# EAGLE design kul_rev0 (EAGLE 9.6.2)
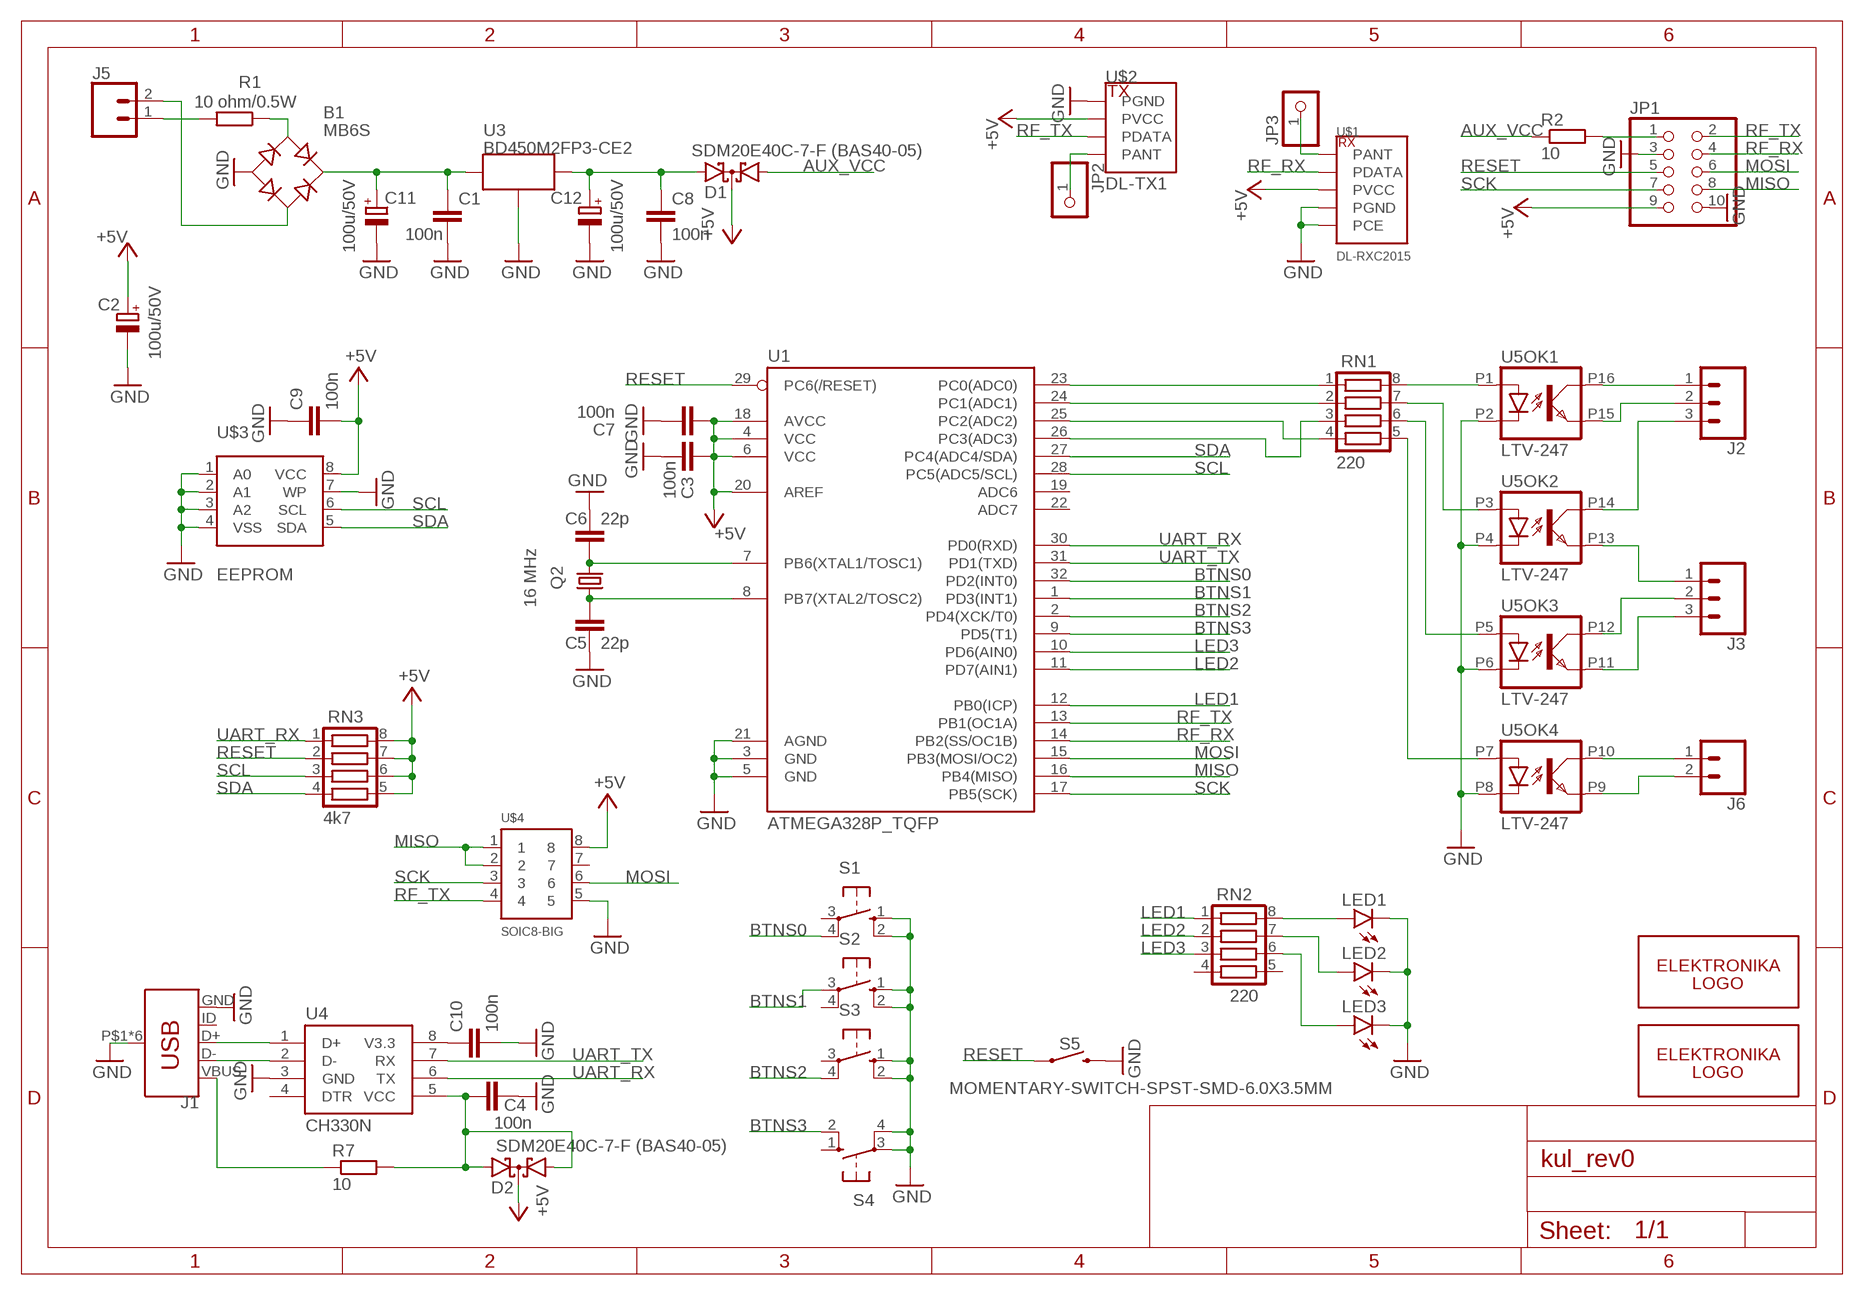
[diagram p0: schematic, sheet 1]

## Parts
B1  MB6S  [SOIC-4]
C1  100n  C-EUC0603  [C0603]
C2  100u/50V  CPOL-EUE5-6  [E5-6]
C3  100n  C-EUC0603  [C0603]
C4  100n  C-EUC0603  [C0603]
C5  22p  C-EUC0603  [C0603]
C6  22p  C-EUC0603  [C0603]
C7  100n  C-EUC0603  [C0603]
C8  100n  C-EUC0603  [C0603]
C9  100n  C-EUC0603  [C0603]
C10  100n  C-EUC0603  [C0603]
C11  100u/50V  CPOL-EUE5-6  [E5-6]
C12  100u/50V  CPOL-EUE5-6  [E5-6]
D1  SDM20E40C-7-F (BAS40-05)  BAS40-05  [SOT23]
D2  SDM20E40C-7-F (BAS40-05)  BAS40-05  [SOT23]
J1  USB_MICRO-BLCSC  [C40951_USB]
J2  CONN_03SCREW_LOCK  [SCREWTERMINAL-3.5MM-3_LOCK.007S]
J3  CONN_03SCREW_LOCK  [SCREWTERMINAL-3.5MM-3_LOCK.007S]
J5  CONN_023.5MM  [SCREWTERMINAL-3.5MM-2]
J6  CONN_023.5MM  [SCREWTERMINAL-3.5MM-2]
JP1  PINHD-2X5  [2X05]
JP2  PINHD-1X1  [1X01]
JP3  PINHD-1X1  [1X01]
LED1  LEDCHIP-LED0805  [CHIP-LED0805]
LED2  LEDCHIP-LED0805  [CHIP-LED0805]
LED3  LEDCHIP-LED0805  [CHIP-LED0805]
Q2  16 MHz  KX-7  [3.2X2.5_KX-7]
R1  10 ohm/0.5W  R-EU_R0805  [R0805]
R2  10  R-EU_R0603  [R0603]
R7  10  R-EU_R0603  [R0603]
RN1  220  CTS742C083  [CTS742C083]
RN2  220  CTS742C083  [CTS742C083]
RN3  4k7  CTS742C083  [CTS742C083]
S1  10-XX  [B3F-10XX]
S2  10-XX  [B3F-10XX]
S3  10-XX  [B3F-10XX]
S4  10-XX  [B3F-10XX]
S5  MOMENTARY-SWITCH-SPST-SMD-6.0X3.5MM  [TACTILE_SWITCH_SMD_6.0X3.5MM]
U1  ATMEGA328P_TQFP  [TQFP32-08]
U3  BD450M2FP3-CE2  C308597_LDO  [C308597_LDO]
U4  CH330N  [SOIC8]
U5  LTV-247  [SOP-16_4.4MM]
U$1  DL-RXC2015  [DL-RXC2015]
U$2  DL-TX1  [DL-TX1]
U$3  EEPROM  [SOIC8]
U$4  SOIC8-BIG  [SOIC8_BIG]
U$5  ELEKTRONIKA_BA_ELEBA_LOGO-121  [ELEKTRONIKA_BA_ELEBALOGO_ELEBALOGO_B_121]
U$6  ELEKTRONIKA_BA_ELEBA_LOGO  [ELEKTRONIKA_BA_ELEBALOGO_ELEBALOGO_B_122]

## Nets
+5V: C2.+ C3.2 C7.2 C9.2 D1.3(C) D2.3(C) JP1.9 RN3.5 RN3.6 RN3.7 RN3.8 U1.4(VCC) U1.6(VCC) U1.18(AVCC) U1.20(AREF) U$1.PVCC U$2.PVDD(PVCC) U$3.8(VCC) U$4.8
AUX_VCC: D1.1(A1) R2.1
BTNS0: S1.4(P1) U1.32(PD2(INT0))
BTNS1: S2.3(P) U1.1(PD3(INT1))
BTNS2: S3.4(P1) U1.2(PD4(XCK/T0))
BTNS3: S4.2(S1) U1.9(PD5(T1))
GND: B1.- C1.2 C2.- C3.1 C4.2 C5.2 C6.1 C7.1 C8.2 C9.1 C10.2 C11.- C12.- J1.GND J1.P$1(SHIELD) J1.P$2(SHIELD) J1.P$3(SHIELD) J1.P$4(SHIELD) J1.SHIELD1(SHIELD) J1.SHIELD2(SHIELD) JP1.3 JP1.10 LED1.C LED2.C LED3.C S1.1(S) S1.2(S1) S2.1(S) S2.2(S1) S3.1(S) S3.2(S1) S4.3(P) S4.4(P1) S5.2 U1.3(GND) U1.5(GND) U1.21(AGND) U3.PGND1(PGND) U3.PGND2(PGND) U4.3(GND) U5.P2(OK1:C) U5.P4(OK2:C) U5.P6(OK3:C) U5.P8(OK4:C) U$1.PCE U$1.PGND1(PGND) U$1.PGND2(PGND) U$2.PGND U$3.1(A0) U$3.2(A1) U$3.3(A2) U$3.4(VSS) U$3.7(WP) U$4.5
LED1: RN2.1 U1.12(PB0(ICP))
LED2: RN2.2 U1.11(PD7(AIN1))
LED3: RN2.3 U1.10(PD6(AIN0))
MISO: JP1.8 U1.16(PB4(MISO)) U$4.1 U$4.2
MOSI: JP1.6 U1.15(PB3(MOSI/OC2)) U$4.6
N$1: RN1.8 U5.P1(OK1:A)
N$2: RN1.7 U5.P3(OK2:A)
N$3: RN1.6 U5.P5(OK3:A)
N$4: RN1.5 U5.P7(OK4:A)
N$5: RN1.4 U1.25(PC2(ADC2))
N$6: RN1.3 U1.26(PC3(ADC3))
N$8: J1.D+ U4.1(D+)
N$9: B1.~1(AC1) R1.1
N$10: B1.~2(AC2) J5.2
N$11: B1.+ C1.1 C11.+ U3.PIN
N$12: C8.1 C12.+ D1.2(A2) U3.POUT
N$13: J5.1 R1.2
N$14: J1.D- U4.2(D-)
N$15: J1.VBUS R7.1
N$16: C4.1 D2.1(A1) D2.2(A2) R7.2 U4.5(VCC)
N$17: C10.1 U4.8(V3.3)
N$18: J2.1 U5.P16(OK1:COL)
N$19: J2.2 U5.P15(OK1:EMIT)
N$20: J2.3 U5.P14(OK2:COL)
N$21: J3.1 U5.P13(OK2:EMIT)
N$22: J3.2 U5.P12(OK3:COL)
N$23: J3.3 U5.P11(OK3:EMIT)
N$24: J6.1 U5.P10(OK4:COL)
N$25: J6.2 U5.P9(OK4:EMIT)
N$26: RN1.1 U1.23(PC0(ADC0))
N$27: RN1.2 U1.24(PC1(ADC1))
N$30: JP2.1 U$2.PANT
N$31: JP3.1 U$1.PANT
N$32: LED1.A RN2.8
N$33: LED2.A RN2.7
N$34: LED3.A RN2.6
N$35: JP1.1 R2.2
OSC1: C6.2 Q2.3 U1.7(PB6(XTAL1/TOSC1))
OSC2: C5.1 Q2.1 U1.8(PB7(XTAL2/TOSC2))
RESET: JP1.5 RN3.2 S5.1 U1.29(PC6(/RESET))
RF_RX: JP1.4 U1.14(PB2(SS/OC1B)) U$1.PDATA
RF_TX: JP1.2 U1.13(PB1(OC1A)) U$2.PDATA U$4.4
SCK: JP1.7 U1.17(PB5(SCK)) U$4.3
SCL: RN3.3 U1.28(PC5(ADC5/SCL)) U$3.6(SCL)
SDA: RN3.4 U1.27(PC4(ADC4/SDA)) U$3.5(SDA)
UART_RX: RN3.1 U1.30(PD0(RXD)) U4.6(TX)
UART_TX: U1.31(PD1(TXD)) U4.7(RX)
Unconnected: J1.ID RN2.4 RN2.5 S1.3(P) S2.4(P1) S3.3(P) S4.1(S) U1.19(ADC6) U1.22(ADC7) U4.4(DTR) U$4.7

## Library data of the parts
B1 = rectifier:MB*S: Bridge Rectifier Source: http://www.fairchildsemi.com/ds/MB/MB6S.pdf
C1 C3-C10 = rcl:C-EU: CAPACITOR, European symbol; SPICEPREFIX: C
C2 C11 C12 = rcl:CPOL-EU: POLARIZED CAPACITOR, European symbol; SPICEPREFIX: C
D1 D2 = diode:BAS40-05: Silicon Schottky Diodes General-purpose diode for high-speed switching
J1 = trax_832:USB_MICRO-B: USB Type Micro-B Connector Male/female and PTH/SMT variants SparkFun Products: SparkFun microB USB Breakout <https://www.sparkfun.com/products/12035> SparkFun USB microB Plug Breakout <https://www.sparkfun.com/products/10031> SparkFun ESP8266 Thing <https://www.sparkfun.com/products/13231>
J2 J3 = SparkFun-Connectors:CONN_03: Multi connection point. Often used as Generic Header-pin footprint for 0.1 inch spaced/style header connections On any of the 0.1 inch spaced packages, you can populate with these: Break Away Headers - Straight <https://www.sparkfun.com/products/116> (PRT-00116) Break Away Male Headers - Right Angle <https://www.sparkfun.com/products/553> (PRT-00553) Female Headers <https://www.sparkfun.com/products/115> (PRT-00115) Break Away Headers - Machine Pin <https://www.sparkfun.com/products/117> (PRT-00117) Break Away Female Headers - Swiss Machine Pin <https://www.sparkfun.com/products/743> (PRT-00743) Stackable Header - 3 Pin (Female, 0.1") <https://www.sparkfun.com/products/13875> (PRT-13875) For SCREWTERMINALS and SPRING TERMINALS visit here: Screw Terimnals on SparkFun.com <https://www.sparkfun.com/search/results?term=Screw+Terminals> (5mm/3.5mm/2.54mm spacing) This device is also useful as a general connection point to wire up your design to another part of your project. Our various solder wires solder well into these plated through hole pads. Hook-Up Wire - Assortment (Stranded, 22 AWG) <https://www.sparkfun.com/products/11375> (PRT-11375) Hook-Up Wire - Assortment (Solid Core, 22 AWG) <https://www.sparkfun.com/products/11367> (PRT-11367) View the entire wire category on our website here <https://www.sparkfun.com/categories/141> Special notes: Molex polarized connector foot print use with SKU : PRT-08232 with associated crimp pins and housings.; PROD_ID: CONN-08288; SF_ID: PRT-08235
J5 J6 = SparkFun-Connectors:CONN_02: Multi connection point. Often used as Generic Header-pin footprint for 0.1 inch spaced/style header connections On any of the 0.1 inch spaced packages, you can populate with these: Break Away Headers - Straight <https://www.sparkfun.com/products/116> (PRT-00116) Break Away Male Headers - Right Angle <https://www.sparkfun.com/products/553> (PRT-00553) Female Headers <https://www.sparkfun.com/products/115> (PRT-00115) Break Away Headers - Machine Pin <https://www.sparkfun.com/products/117> (PRT-00117) Break Away Female Headers - Swiss Machine Pin <https://www.sparkfun.com/products/743> (PRT-00743) For SCREWTERMINALS and SPRING TERMINALS visit here: Screw Terimnals on SparkFun.com <https://www.sparkfun.com/search/results?term=Screw+Terminals> (5mm/3.5mm/2.54mm spacing) This device is also useful as a general connection point to wire up your design to another part of your project. Our various solder wires solder well into these plated through hole pads. Hook-Up Wire - Assortment (Stranded, 22 AWG) <https://www.sparkfun.com/products/11375> (PRT-11375) Hook-Up Wire - Assortment (Solid Core, 22 AWG) <https://www.sparkfun.com/products/11367> (PRT-11367) View the entire wire category on our website here <https://www.sparkfun.com/categories/141> Special notes: Molex polarized connector foot print use with: PRT-08233 with associated crimp pins and housings. 2.54_SCREWTERM for use with PRT-10571. 3.5mm Screw Terminal footprints for PRT-08084 5mm Screw Terminal footprints for use with PRT-08432; PROD_ID: CONN-08399
JP1 = pinhead:PINHD-2X5: PIN HEADER
JP2 JP3 = pinhead:PINHD-1X1: PIN HEADER
LED1-LED3 = led:LED: LED OSRAM: - CHIPLED LG R971, LG N971, LY N971, LG Q971, LY Q971, LO R971, LY R971 LH N974, LH R974 LS Q976, LO Q976, LY Q976 LO Q996 - Hyper CHIPLED LW Q18S LB Q993, LB Q99A, LB R99A - SideLED LS A670, LO A670, LY A670, LG A670, LP A670 LB A673, LV A673, LT A673, LW A673 LH A674 LY A675 LS A676, LA A676, LO A676, LY A676, LW A676 LS A679, LY A679, LG A679 - Hyper Micro SIDELED® LS Y876, LA Y876, LO Y876, LY Y876 LT Y87S - SmartLED LW L88C, LW L88S LB L89C, LB L89S, LG L890 LS L89K, LO L89K, LY L89K LS L896, LA L896, LO L896, LY L896 - TOPLED LS T670, LO T670, LY T670, LG T670, LP T670 LSG T670, LSP T670, LSY T670, LOP T670, LYG T670 LG T671, LOG T671, LSG T671 LB T673, LV T673, LT T673, LW T673 LH T674 LS T676, LA T676, LO T676, LY T676, LB T676, LH T676, LSB T676, LW T676 LB T67C, LV T67C, LT T67C, LS T67K, LO T67K, LY T67K, LW E67C LS E67B, LA E67B, LO E67B, LY E67B, LB E67C, LV E67C, LT E67C LW T67C LS T679, LY T679, LG T679 LS T770, LO T770, LY T770, LG T770, LP T770 LB T773, LV T773, LT T773, LW T773 LH T774 LS E675, LA E675, LY E675, LS T675 LS T776, LA T776, LO T776, LY T776, LB T776 LHGB T686 LT T68C, LB T68C - Hyper Mini TOPLED® LB M676 - Mini TOPLED Santana® LG M470 LS M47K, LO M47K, LY M47K Source: http://www.osram.convergy.de LUXEON: - LUMILED® LXK2-PW12-R00, LXK2-PW12-S00, LXK2-PW14-U00, LXK2-PW14-V00 LXK2-PM12-R00, LXK2-PM12-S00, LXK2-PM14-U00 LXK2-PE12-Q00, LXK2-PE12-R00, LXK2-PE12-S00, LXK2-PE14-T00, LXK2-PE14-U00 LXK2-PB12-K00, LXK2-PB12-L00, LXK2-PB12-M00, LXK2-PB14-N00, LXK2-PB14-P00, LXK2-PB14-Q00 LXK2-PR12-L00, LXK2-PR12-M00, LXK2-PR14-Q00, LXK2-PR14-R00 LXK2-PD12-Q00, LXK2-PD12-R00, LXK2-PD12-S00 LXK2-PH12-R00, LXK2-PH12-S00 LXK2-PL12-P00, LXK2-PL12-Q00, LXK2-PL12-R00 Source: www.luxeon.com KINGBRIGHT: KA-3528ASYC Source: www.kingbright.com
Q2 = crystal-geyer_V1_0:KX: Quartz Crystals (MHz) SMD: KX - Serie Model Size l/w/h [mm] Frequency Range Frequency Stability Temp. Range [°C] Load Capacitance AECQ 200 availabel Datasheet KX-4 KX-5 KX-6 KX-7 KX-9A KX-9B KX-12A KX-12B KX-13 KX-20 KX-K KX-KS 1.6/1.2/0.3 2.0/1.6/0.45 2.5/2.0/0.55 3.2/2.5/0.8 5.0/3.2/1.0 5.0/3.2/1.1 6.0/3.5/1.1 6.0/3.5/1.0 7.0/5.0 /1.3 11.6/5.5/1.6 12.3/4.5/4.2 12.3/4.5/3.2 24.0 ~ 80.0 MHz 16.0 ~ 80.0 MHz 12.0 ~ 80.0 MHz 8.0 ~ 60.0 MHz 7,68 ~ 300,0 MHz 8,0 ~ 50,0 MHz 8,0 ~ 150,0 MHz 8,0 ~ 50,0 MHz 6,0 ~ 160,0 MHz 3,579 ~ 25,0 MHz 3,579 ~ 70,0 MHz 3,579 ~ 70,0 MHz ±10 … ±50ppm ±10 … ±50ppm ±10 … ±50ppm ±10 … ±50ppm ±10 … ±50ppm ±10 … ±50ppm ±10 … ±50ppm ±10 … ±50ppm ±10 … ±50ppm ±50ppm ±10 … ±50ppm ±10 … ±50ppm (*) -40°C …+85°C (*) -40°C …+125°C (*) -40°C …+125°C (*) -40°C …+125°C (*) -40°C …+105°C (*) -40°C …+105°C (*) -40°C …+125°C (*) -40°C …+105°C (*) -40°C …+105°C (*) -40°C …+105°C (*) -40°C …+85°C (*) -40°C …+85°C 8, 8…16 8, 8…16 10, 8…16 12, 7…20 16, 10…20 16, 10…20 16, 10…20 16, 12…20 16, 12…20 16, 12…20 16, 12…30 16, 12…30 - yes yes yes - - - - - - - - KX-4.pdf <http://www.geyer-electronic.de/uploads/tx_userartikelfrequenz/GEYER-KX-4.pdf> KX-5.pdf <http://www.geyer-electronic.de/uploads/tx_userartikelfrequenz/GEYER-KX-5.pdf> KX-6.pdf <http://www.geyer-electronic.de/uploads/tx_userartikelfrequenz/GEYER-KX-6.pdf> KX-7.pdf <http://www.geyer-electronic.de/uploads/tx_userartikelfrequenz/GEYER-KX-7.pdf> KX-9A.pdf <http://www.geyer-electronic.de/uploads/tx_userartikelfrequenz/GEYER-KX-9A.pdf> KX-9B.pdf <http://www.geyer-electronic.de/uploads/tx_userartikelfrequenz/GEYER-KX-9B.pdf> KX-12A.pdf <http://www.geyer-electronic.de/uploads/tx_userartikelfrequenz/GEYER-KX-12A.pdf> KX-12B.pdf <http://www.geyer-electronic.de/uploads/tx_userartikelfrequenz/GEYER-KX-12B.pdf> KX-13.pdf <http://www.geyer-electronic.de/uploads/tx_userartikelfrequenz/GEYER-KX-13.pdf> KX-20.pdf <http://www.geyer-electronic.de/uploads/tx_userartikelfrequenz/GEYER-KX-20.pdf> KX-K.pdf <http://www.geyer-electronic.de/uploads/tx_userartikelfrequenz/GEYER-KX-K.pdf> KX-KS.pdf <http://www.geyer-electronic.de/uploads/tx_userartikelfrequenz/GEYER-KX-KS.pdf> <http://www.geyer-electronic.de/fileadmin/template/img/logo-geyer-electronic.png> Details see: http://www.geyer-electronic.de/Frequenz-Produkte.9.0.html Created 2016-06-07, Hans Locher 2016 (C) Geyer Quartz Technology KX4,KX5,KX6,KX7,KX9A,KX9B,KX12A,KX12B,KX13,KX20,KXK,KXKS;1612;2016;2520;3225;5032;6035;7050;11655;12345;1,6x1,2;2,0x1,6;2,5x2,0;3,2x2,5;5,0x3,2;6,0x3,5;7,0x5,0;11,6x5,5;12,3x4,5;12,3x4,5;1.6x1.2;2.0x1.6;2.5x2.0;3.2x2.5;5.0x3.2;6.0x3.5;7.0x5.0;11.6x5.5;12.3x4.5;12.3x4.5;
R1 R2 R7 = rcl:R-EU_: RESISTOR, European symbol; SPICEPREFIX: R
RN1-RN3 = resistor-net:CTS742C083: Chip Resistor Array 4 Single Resistor Source: http://www.ctscorp.com/components/Datasheets/CTSChipArrayDs.pdf; OC_FARNELL: unknown; OC_NEWARK: unknown
S1-S4 = trax_832:10-XX: OMRON SWITCH; MPN: B3F-1000; OC_FARNELL: 176432; OC_NEWARK: 36M3542
S5 = SparkFun-Switches:MOMENTARY-SWITCH-SPST: Momentary Switch (Pushbutton) - SPST Normally-open (NO) SPST momentary switches (buttons, pushbuttons). Variants PTH-12MM - 12mm square, through-hole Momentary Pushbutton Switch - 12mm Square <https://www.sparkfun.com/products/9190> (COM-09190) PTH-6.0MM, PTH-6.0MM-KIT - 6.0mm square, through-hole Mini Pushbutton Switch <https://www.sparkfun.com/products/97> (COM-00097) KIT package intended for soldering kit's - only one side of pads' copper is exposed. PTH-RIGHT-ANGLE-KIT - Right-angle, through-hole Right Angle Tactile Button <https://www.sparkfun.com/products/10791> - Used on SparkFun BigTime Watch Kit <https://www.sparkfun.com/products/11734> SMD-12MM - 12mm square, surface-mount Tactile Button - SMD (12mm) <https://www.sparkfun.com/products/12993> (COM-12993) Used on SparkFun PicoBoard <https://www.sparkfun.com/products/11888> SMD-4.5MM - 4.5mm Square Trackball Switch Used on SparkFun Blackberry Trackballer Breakout <https://www.sparkfun.com/products/13169> SMD-4.6MMX2.8MM - 4.60mm x 2.80mm, surface mount Used on SparkFun SAMD21 Mini Breakout <https://www.sparkfun.com/products/13664> SMD-5.2MM, SMD-5.2-REDUNDANT - 5.2mm square, surface-mount Mini Pushbutton Switch - SMD <https://www.sparkfun.com/products/8720> (COM-08720) Used on Arduino Pro Mini <https://www.sparkfun.com/products/11114> REDUNDANT package connects both switch circuits together SMD-6.0X3.5MM - 6.0 x 3.5mm, surface mount Momentary Reset Switch SMD <https://www.sparkfun.com/products/8229> (COM-08229) SMD-6.2MM-TALL - 6.2mm square, surface mount Tactile Button - SMD (6mm) <https://www.sparkfun.com/products/12992> Used on SparkFun Digital Sandbox <https://www.sparkfun.com/products/12651> SMD-RIGHT-ANGLE - Right-angle, surface mount Used on SparkFun Block for Intel® Edison - Arduino <https://www.sparkfun.com/products/13036>; PROD_ID: SWCH-00815; SF_SKU: COM-08229
U1 = SparkFun-IC-Microcontroller:ATMEGA328P_TQFP: Popular 328P in QFP Storefront component: ATmega328 - TQFP <https://www.sparkfun.com/products/13448> (COM-13448) Datasheet <http://www.sparkfun.com/datasheets/Components/SMD/ATMega328.pdf> SparkFun Products SparkFun RedBoard - Programmed with Arduino <https://www.sparkfun.com/products/12757> (DEV-12757) Arduino Pro Mini 328 - 5V/16MHz <https://www.sparkfun.com/products/11113> (DEV-11113) Arduino Pro Mini 328 - 3.3V/8MHz <https://www.sparkfun.com/products/11114> (DEV-11114) SparkFun OpenLog <https://www.sparkfun.com/products/13712> (DEV-13712) SparkFun MicroView - OLED Arduino Module <https://www.sparkfun.com/products/12923> (DEV-12923) SparkFun Digital Sandbox <https://www.sparkfun.com/products/12651> (DEV-12651) SparkFun PicoBoard <https://www.sparkfun.com/products/11888> (WIG-11888) Arduino Fio <https://www.sparkfun.com/products/10116> (DEV-10116) LilyPad Arduino 328 Main Board <https://www.sparkfun.com/products/13342> (DEV-13342) SparkFun RedStick <https://www.sparkfun.com/products/13741> (DEV-13741) LilyPad MP3 <https://www.sparkfun.com/products/11013> (DEV-11013) LilyPad Arduino SimpleSnap <https://www.sparkfun.com/products/10941> (DEV-10941) SparkFun Stepoko <https://www.sparkfun.com/products/13899> (ROB-13899) SparkFun Geiger Counter <https://www.sparkfun.com/products/11345> (SEN-11345) SparkFun EL Sequencer <https://www.sparkfun.com/products/12781> (COM-12781) Arduino Pro 328 - 5V/16MHz <https://www.sparkfun.com/products/10915> (DEV-10915) CryptoCape <https://www.sparkfun.com/products/12773> (DEV-12773) SparkFun IR Thermometer Evaluation Board - MLX90614 <https://www.sparkfun.com/products/10740> (SEN-10740) SparkFun RedBot Mainboard <https://www.sparkfun.com/products/12097> (ROB-12097) Arduino Pro 328 - 3.3V/8MHz <https://www.sparkfun.com/products/10914> (DEV-10914) SparkFun Block for Intel® Edison - Arduino <https://www.sparkfun.com/products/13036> (DEV-13036) SparkFun Simon Says - Surface Mount Soldering Kit <https://www.sparkfun.com/products/10935> (KIT-10935) SparkFun 7-Segment Serial Display - Red <https://www.sparkfun.com/products/11441> (COM-11441) SparkFun 7-Segment Serial Display - White <https://www.sparkfun.com/products/11629> (COM-11629) SparkFun 7-Segment Serial Display - Yellow <https://www.sparkfun.com/products/11443> (COM-11443) SparkFun 7-Segment Serial Display - Kelly Green <https://www.sparkfun.com/products/11440> (COM-11440) SparkFun 7-Segment Serial Display - Blue <https://www.sparkfun.com/products/11442> (COM-11442) SparkFun OpenSegment Serial Display - 20mm (Blue) <https://www.sparkfun.com/products/11647> (COM-11647) SparkFun OpenSegment Serial Display - 20mm (Green) <https://www.sparkfun.com/products/11646> (COM-11646) SparkFun OpenSegment Serial Display - 20mm (White) <https://www.sparkfun.com/products/11648> (COM-11648) SparkFun OpenSegment Serial Display - 20mm (Red) <https://www.sparkfun.com/products/11644> (COM-11644) SparkFun OpenSegment Serial Display - 20mm (Yellow) <https://www.sparkfun.com/products/11645> (COM-11645) SparkFun OpenSegment Shield <https://www.sparkfun.com/products/13190> (DEV-13190); PROD_ID: IC-09069
U3 = trax_832:C308597_LDO
U4 = trax_832:CH330N
U5 = trax_832:LTV-247
U$1 = trax_832:DL-RXC2015
U$2 = trax_832:DL-TX1
U$3 = trax_832:EEPROM
U$4 = trax_832:SOIC8-BIG
U$5 U$6 = elebalogo:ELEKTRONIKA_BA_ELEBA_LOGO

## Board
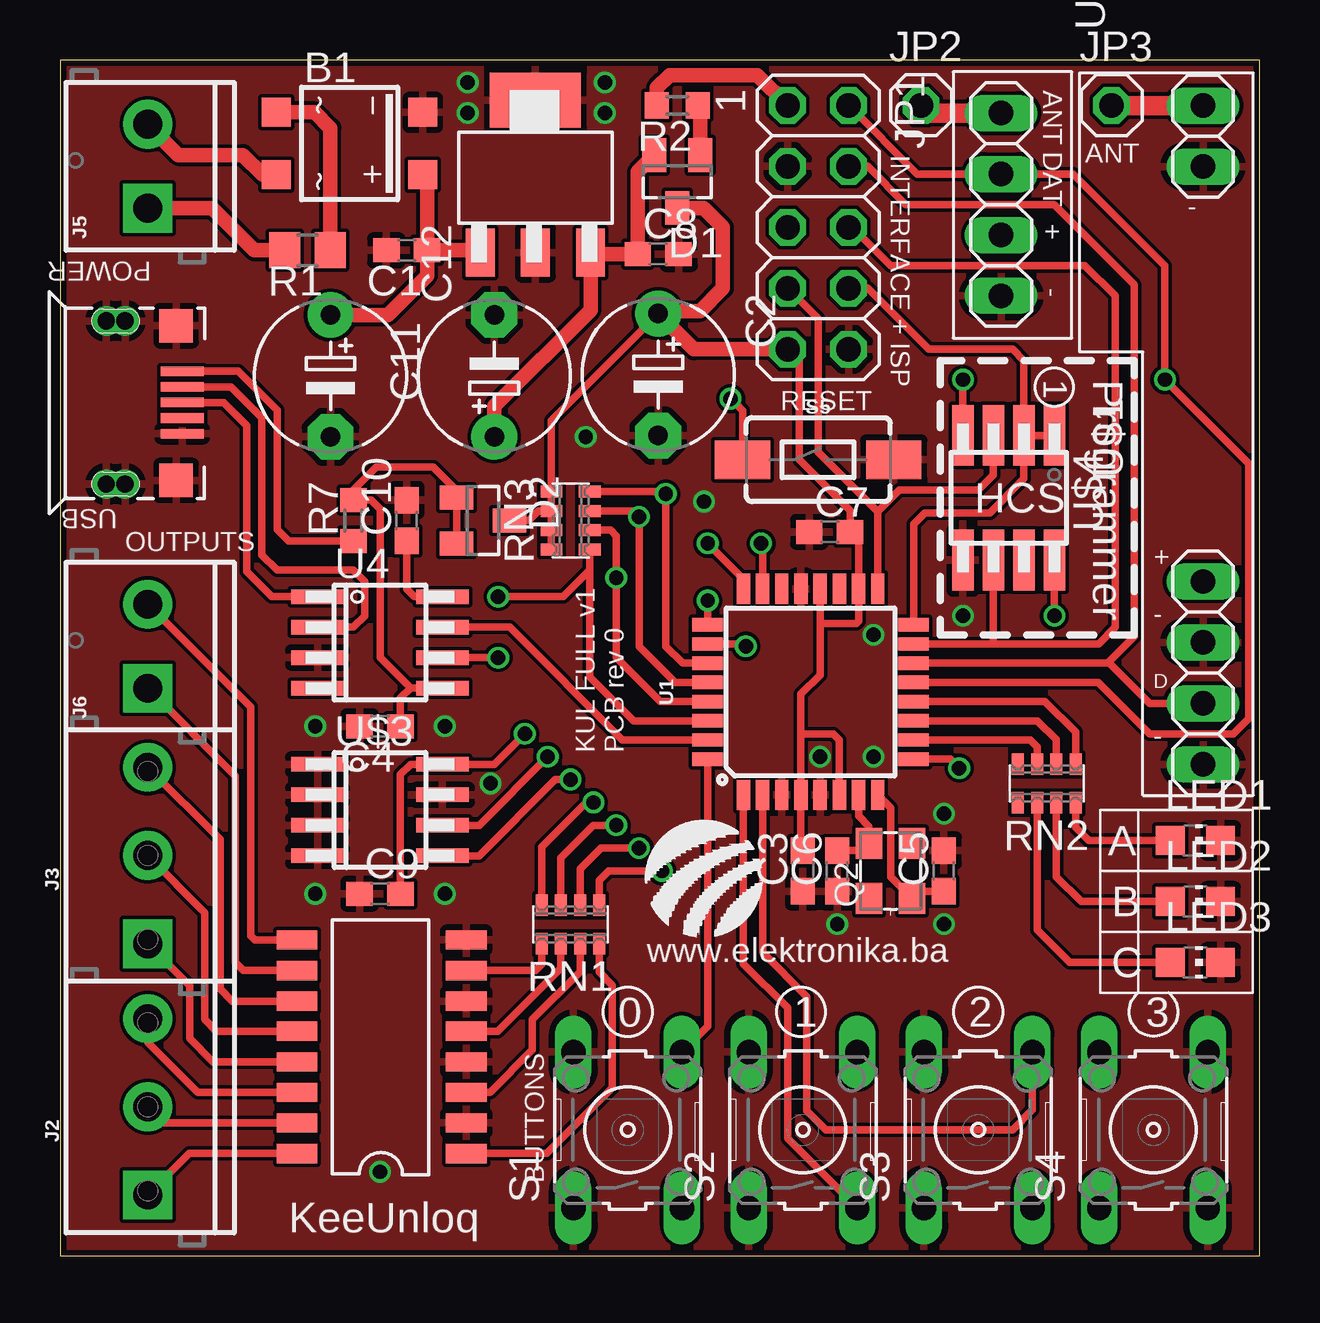
[diagram p1: board, top side]
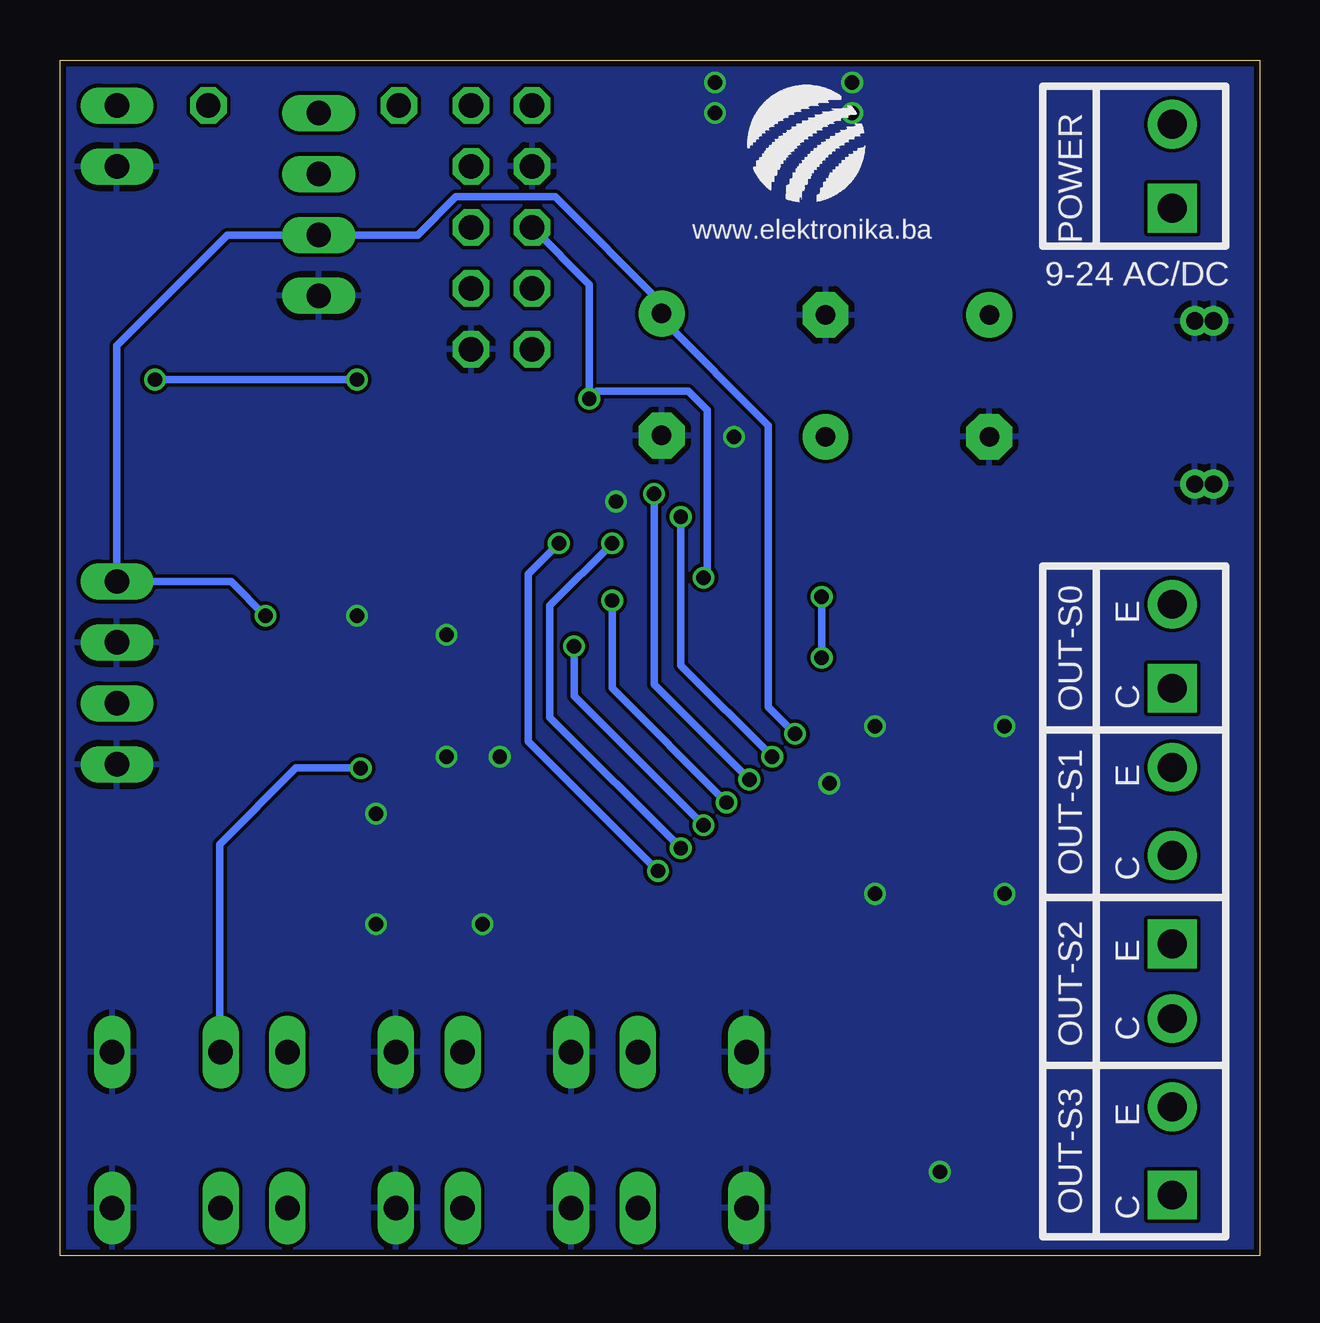
[diagram p2: board, bottom side, seen from below]

Size 49.99 x 49.84 mm. Coordinates in mm from the lower left corner, seen from the top.
Outline: 0,0 49.99,0 49.99,49.84 0,49.84 0,0
Copper layers (1*16): Top 0.035mm / dielectric 1.5mm / Bottom 0.035mm
Design rules "Fusion_eagle_rule_v1.1": minimum track width 6mil, minimum drill 12mil, track to track 6mil, track to pad 6mil, pad to pad 6mil, via to via 6mil, smd to smd 0mil, copper to edge 10mil, drill to drill 10mil, minimum pad ring 10mil, minimum via ring 6mil, stop-mask expansion 2mil, vias tented up to drill 100mil, thermal gap 10mil

### Footprints (pad centres in the part's own frame; a part is rotated, then mirrored left to right if it is on the bottom)
SOIC-4 = smd 1.2 x 1.2: + 1.3,3.05; - -1.3,3.05; ~1 -1.3,-3.05; ~2 1.3,-3.05
C0603 = smd 1.1 x 1: 1 -0.85,0; 2 0.85,0
E5-6 = drill 0.813 pad 1.905: + -2.54,0 | drill 0.813 pad 1.905 octagon: - 2.54,0
SOT23 = smd 1 x 1.4: 1 -0.95,-1.1; 2 0.95,-1.1; 3 0,1.1
C40951_USB = smd 1.8 x 0.4: D+ -2.55,0; D- -2.55,-0.65; GND -2.55,1.3; ID -2.55,0.65; VBUS -2.55,-1.3 | drill 0.72 pad 1.2: P$1 -0.17,3.4; P$2 0.61,3.4; P$3 -0.17,-3.4; P$4 0.61,-3.4 | smd 1.4 x 1.4: SHIELD1 -2.3,3.25; SHIELD2 -2.3,-3.2
SCREWTERMINAL-3.5MM-3_LOCK.007S = drill 1.2 pad 2.032 square: 1 -0.178,0 | drill 1.2 pad 2.032: 2 3.5,0; 3 7.178,0
SCREWTERMINAL-3.5MM-2 = drill 1.2 pad 2.032 square: 1 0,0 | drill 1.2 pad 2.032: 2 3.5,0
2X05 = drill 1.016 octagon: 1 -5.08,-1.27; 2 -5.08,1.27; 3 -2.54,-1.27; 4 -2.54,1.27; 5 0,-1.27; 6 0,1.27; 7 2.54,-1.27; 8 2.54,1.27; 9 5.08,-1.27; 10 5.08,1.27
1X01 = drill 1.016 octagon: 1 0,0
CHIP-LED0805 = smd 1.2 x 1.2: A 0,-1.05; C 0,1.05
3.2X2.5_KX-7 = smd 1.3 x 1.1: 1 -1.15,-0.9; 2 1.15,-0.9; 3 1.15,0.9; 4 -1.15,0.9
R0805 = smd 1.3 x 1.5: 1 -0.95,0; 2 0.95,0
R0603 = smd 1 x 1.1: 1 -0.85,0; 2 0.85,0
CTS742C083 = smd 0.5 x 0.9: 1 -1.2,-0.8; 2 -0.4,-0.8; 3 0.4,-0.8; 4 1.2,-0.8; 5 1.2,0.8; 6 0.4,0.8; 7 -0.4,0.8; 8 -1.2,0.8
B3F-10XX = drill 1.016 long: 1 -3.251,2.261; 2 3.251,2.261; 3 -3.251,-2.261; 4 3.251,-2.261
TACTILE_SWITCH_SMD_6.0X3.5MM = smd 2.3 x 1.6: 1 -3.15,0; 2 3.15,0
TQFP32-08 = smd 1.27 x 0.559: 1 -4.293,2.8; 2 -4.293,2; 3 -4.293,1.2; 4 -4.293,0.4; 5 -4.293,-0.4; 6 -4.293,-1.2; 7 -4.293,-2; 8 -4.293,-2.8; 17 4.293,-2.8; 18 4.293,-2; 19 4.293,-1.2; 20 4.293,-0.4; 21 4.293,0.4; 22 4.293,1.2; 23 4.293,2; 24 4.293,2.8 | smd 0.559 x 1.27: 9 -2.8,-4.293; 10 -2,-4.293; 11 -1.2,-4.293; 12 -0.4,-4.293; 13 0.4,-4.293; 14 1.2,-4.293; 15 2,-4.293; 16 2.8,-4.293; 25 2.8,4.293; 26 2,4.293; 27 1.2,4.293; 28 0.4,4.293; 29 -0.4,4.293; 30 -1.2,4.293; 31 -2,4.293; 32 -2.8,4.293
C308597_LDO = smd 2.3 x 3.8: PGND1 -3.232,-0.036 | smd 2 x 1.2: PGND2 3.118,-0.036; PIN 3.118,-2.336; POUT 3.118,2.264
SOIC8 = smd 0.6 x 2.2: 1 -1.905,-2.6; 2 -0.635,-2.6; 3 0.635,-2.6; 4 1.905,-2.6; 5 1.905,2.6; 6 0.635,2.6; 7 -0.635,2.6; 8 -1.905,2.6
SOP-16_4.4MM = smd 0.8 x 1.7: P1 -4.476,-3.591; P2 -3.201,-3.591; P3 -1.926,-3.591; P4 -0.651,-3.591; P5 0.624,-3.591; P6 1.874,-3.591; P7 3.149,-3.591; P8 4.424,-3.591; P9 4.424,3.458; P10 3.149,3.458; P11 1.874,3.458; P12 0.624,3.458; P13 -0.651,3.458; P14 -1.926,3.458; P15 -3.201,3.458; P16 -4.476,3.458
DL-RXC2015 = drill 1.016 long: PANT 27.46,0; PCE 5.08,0; PDATA 2.54,0; PGND1 24.92,0; PGND2 0,0; PVCC 7.62,0
DL-TX1 = drill 1.016 long: PANT 0,0; PDATA 2.54,0; PGND 7.62,0; PVDD 5.08,0
SOIC8_BIG = smd 0.889 x 2.54: 1 -1.905,-2.6; 2 -0.635,-2.6; 3 0.635,-2.6; 4 1.905,-2.6; 5 1.905,2.6; 6 0.635,2.6; 7 -0.635,2.6; 8 -1.905,2.6

### Placement (x,y rotation side)
B1  12.06,46.35 270 top
C1  14.45,41.91 180 top
C2  24.92,36.73 270 top
C3  30.96,16.03 90 top
C4  13.34,22.07 180 top
C5  36.83,16.03 90 top
C6  32.38,16.03 90 top
C7  32.07,30.16 0 top
C8  24.92,41.75 0 top
C9  13.34,15.08 0 top
C10  14.45,30.64 90 top
C11  11.27,36.67 270 top
C12  18.1,36.67 90 top
D1  25.72,44.77 180 top
D2  17.62,30.64 270 top
J1  2.54,35.56 180 top
J2  3.65,2.7 90 top
J3  3.65,13.18 90 top
J5  3.65,43.66 90 top
J6  3.65,23.65 90 top
JP1  31.59,42.86 270 top
JP2  35.88,47.94 0 top
JP3  43.81,47.94 0 top
LED1  47.31,17.3 270 top
LED2  47.31,14.76 270 top
LED3  47.31,12.22 270 top
Q2  34.61,16.03 90 top
R1  10.32,41.91 180 top
R2  25.72,47.94 180 top
R7  12.22,30.64 90 top
RN1  21.27,13.81 180 top
RN2  41.12,19.68 180 top
RN3  21.27,30.64 90 top
S1  23.65,5.24 90 top
S2  30.96,5.24 90 top
S3  38.26,5.24 90 top
S4  45.56,5.24 90 top
S5  31.59,33.18 0 top
U1  31.27,23.5 90 top
U3  19.84,44.93 270 top
U4  13.34,25.56 270 top
U5  13.34,8.73 90 top
U$1  47.62,20.48 90 top
U$2  39.21,47.62 270 top
U$3  13.34,18.57 270 top
U$4  39.53,31.59 180 top
U$5  26.83,15.72 0 top
U$6  18.89,46.35 0 bottom

### Tracks (layer width: path | path; a pad name or v marks a point on that pad's centre or on a via)
+5V  (via drill 0.6)
  Top 0.305: C3.2 30.87,16.97 U1.4 30.87,21.75 | C9.2 14.19,20.06 14.61,20.48 U$3.8 18.1,20.48 v19.37,21.75 | RN3.6 RN3.5 20.47,34.81 C2.+ | RN3.6 RN3.7 RN3.8 | RN3.6 19.93,31.04 19.53,30.64 D2.3 | U1.20 31.67,26.35 | 31.67,26.35 31.67,24.21 30.87,23.41 30.87,21.75 | 31.67,26.35 33.18,26.35 33.27,26.45 U1.18 33.27,29.81 C7.2 32.92,31.06 30.8,33.18 30.8,37.31 JP1.9 | U1.6 32.47,21.5 32.23,21.75 30.87,21.75 | U$4.8 v41.43,26.67
  Top 0.61: D1.3 26.82,43.67 27.62,42.86 27.62,40.32 26.67,39.37 25.03,39.37 C2.+ 26.41,37.78 JP1.9
  Bottom 0.305: v19.37,21.75 20.48,22.86 20.48,34.61 24.92,39.05 C2.+ 24.92,39.69 29.37,44.13 33.5,44.13 35.08,42.55 U$2.PVDD 43.02,42.55 47.62,37.94 U$1.PVCC 42.86,28.1 v41.43,26.67
AUX_VCC
  Top 0.61: D1.1 26.67,47.84 R2.1
BTNS0
  Top 0.305: U1.32 26.98,9.56 S1.4
BTNS1
  Top 0.305: S2.3 30.32,4.88 30.32,10.32 28.47,12.17 U1.1
BTNS2
  Top 0.305: U1.2 29.27,12.64 31.11,10.79 31.11,6.03 31.91,5.24 39.69,5.24 40.52,6.07 S3.4
BTNS3  (via drill 0.6)
  Top 0.305: U1.9 37.09,20.7 v37.47,20.32
  Bottom 0.305: v37.47,20.32 40.16,20.32 43.34,17.14 43.34,8.53 S4.2
GND  (via drill 0.6)
  other vias: 36.83,18.41 32.38,13.81 26.83,31.43 37.62,26.67 17.94,19.68 21.91,34.13 31.67,20.8 22.7,48.9 22.7,47.62 16.99,48.9 16.99,47.62 13.34,3.49 16.03,15.08 16.03,22.07 10.64,15.08 10.64,22.07 33.89,20.8 36.83,13.81 33.89,25.88
  pour Bottom: -0.79,50.48 50.64,50.48 50.64,-0.64 -0.79,-0.64
  pour Top: -0.79,50.64 50.8,50.64 50.8,-0.79 -0.64,-0.79
LED1
  Top 0.305: RN2.1 42.32,21.82 41.04,23.09 U1.12
LED2
  Top 0.305: RN2.2 41.52,21.51 40.73,22.3 U1.11
LED3
  Top 0.305: RN2.3 40.72,21.2 40.42,21.5 U1.10
MISO
  Top 0.305: JP1.8 33.66,40.32 36.2,37.78 39.69,37.78 40.16,37.31 U$4.2 | U1.16 35.57,30.49 36.04,30.96 38.73,30.96 40.16,32.38 U$4.2 | U$4.2 U$4.1
MOSI
  Top 0.305: U1.15 38.89,25.5 | 38.89,25.5 43.27,25.5 43.97,26.19 43.97,40.01 42.7,41.27 34.61,41.27 33.02,42.86 JP1.6 | U$4.6 38.89,25.5
N$1
  Top 0.305: RN1.8 22.47,11.82 23.02,11.27 23.02,6.99 20.29,4.25 U5.P1
N$2
  Top 0.305: RN1.7 21.67,11.83 19.68,9.84 19.68,8.57 17.92,6.81 U5.P3
N$3
  Top 0.305: RN1.6 20.87,11.98 18.25,9.36 U5.P5
N$4
  Top 0.305: RN1.5 20.07,12.13 19.82,11.88 U5.P7
N$5  (via drill 0.6)
  Top 0.305: U1.25 v26.98,27.3 v26.99,27.3 | RN1.4 20.07,17.05 21.92,18.89 v22.23,18.89
  Bottom 0.305: v22.23,18.89 26.99,23.65 v26.99,27.3
N$6  (via drill 0.6)
  Top 0.305: U1.26 28.48,25.5 v28.57,25.4 | RN1.3 20.87,16.59 22.23,17.94 v23.18,17.94
  Bottom 0.305: v23.18,17.94 28.57,23.34 v28.57,25.4
N$8
  Top 0.305: J1.D+ 6.83,35.56 7.78,34.61 7.78,28.52 8.83,27.46 U4.1
N$9
  Top 0.61: R1.1 11.27,46.99 10.61,47.66 B1.~1
N$10
  Top 0.61: J5.2 4.93,45.88 7.62,45.88 8.44,45.05 B1.~2
N$11
  Top 0.305: 17.45,41.91 U3.PIN
  Top 0.61: C1.1 15.3,44.87 B1.+ | C1.1 17.45,41.91 | C1.1 15.3,40.85 13.65,39.21 C11.+
N$12
  Top 0.61: C12.+ 18.1,35.4 22.11,39.41 U3.POUT 22.16,41.75 C8.1 24.07,45.17 D1.2
N$13
  Top 0.61: J5.1 6.35,43.66 8.1,41.91 R1.2
N$14
  Top 0.305: J1.D- 7.13,36.21 8.41,34.92 8.41,29.21 9.05,28.57 12.22,28.57 12.7,28.1 12.7,26.67 12.22,26.19 U4.2
N$15
  Top 0.305: J1.VBUS 7.43,36.86 9.05,35.24 9.05,30.27 9.53,29.79 R7.1
N$16
  Top 0.305: C4.1 14.19,23.23 14.61,23.65 | D2.2 D2.1 16.52,31.9 15.56,32.86 13.18,32.86 12.22,31.91 R7.2 12.96,31.49 13.34,31.11 13.34,24.92 14.61,23.65 | U4.5 14.61,23.65
N$17
  Top 0.305: C10.1 14.45,27.78 14.76,27.46 U4.8
N$18
  Top 0.305: U5.P16 5.39,4.25 J2.1
N$19
  Top 0.305: U5.P15 4.32,5.53 J2.2
N$20
  Top 0.305: U5.P14 5.74,6.81 3.65,8.89 J2.3
N$21
  Top 0.305: U5.P13 6.37,8.08 5.4,9.05 5.4,11.25 J3.1
N$22
  Top 0.305: U5.P12 6.52,9.36 6.03,9.84 6.03,14.29 J3.2
N$23
  Top 0.305: U5.P11 7.17,10.61 6.67,11.11 6.67,17.34 J3.3
N$24
  Top 0.305: U5.P10 7.65,11.88 7.3,12.22 7.3,20 J6.1
N$25
  Top 0.305: U5.P9 8.12,13.15 7.94,13.34 7.94,22.87 J6.2
N$26  (via drill 0.6)
  Top 0.305: RN1.1 22.47,15.65 22.86,16.03 v25.08,16.03 | U1.23 29.27,29.62 v29.21,29.69
  Bottom 0.305: v25.08,16.03 30.48,21.43 30.48,28.42 v29.21,29.69
N$27  (via drill 0.6)
  Top 0.305: U1.24 28.47,28.2 v26.99,29.69 | RN1.2 21.67,16.12 22.54,16.99 v24.13,16.99
  Bottom 0.305: v24.13,16.99 29.58,22.44 29.58,27.09 v26.99,29.69
N$30
  Top 0.813: U$2.PANT 36.2,47.62 JP2.1
N$31
  Top 0.813: U$1.PANT JP3.1
N$32
  Top 0.305: RN2.8 42.32,17.85 42.86,17.3 LED1.A
N$33
  Top 0.305: RN2.7 41.52,15.79 42.55,14.76 LED2.A
N$34
  Top 0.305: RN2.6 40.72,13.58 42.07,12.22 LED3.A
N$35
  Top 0.61: R2.2 24.87,48.68 25.4,49.21 29.05,49.21 JP1.1
OSC1
  Top 0.305: U1.7 33.27,18.32 33.71,17.89 Q2.3 33.41,16.88 C6.2
OSC2
  Top 0.305: U1.8 34.61,18.67 34.61,15.78 Q2.1 35.81,15.18 C5.1
RESET  (via drill 0.6)
  Top 0.305: U1.29 25.01,23.09 23.18,24.92 v23.18,28.26 23.18,30 22.94,30.24 RN3.2 | v27.94,35.72 28.44,35.22 S5.1
  Bottom 0.305: v23.18,28.26 23.02,28.42 23.02,35.24 23.81,36.04 27.62,36.04 v27.94,35.72 27.94,40.48 JP1.5
RF_RX
  Top 0.305: U1.14 43.66,24.7 | 43.66,24.7 43.73,24.7 45.4,23.02 U$1.PDATA | JP1.4 33.66,45.4 35.24,43.81 41.43,43.81 44.77,40.48 44.77,25.81 43.66,24.7
RF_TX  (via drill 0.6)
  Top 0.305: U1.13 43.26,23.89 45.4,21.75 48.9,21.75 49.53,22.38 49.53,33.02 v46.04,36.51 46.04,41.27 42.23,45.09 U$2.PDATA 35.72,45.09 JP1.2 | U$4.4 v37.62,36.51
  Bottom 0.305: v46.04,36.51 v37.62,36.51
SCK
  Top 0.305: 34.07,31.01 U1.17 | JP1.7 31.59,39.05 31.59,33.5 34.07,31.01 | U$4.3 38.89,32.54 38.26,31.91 34.97,31.91 34.07,31.01
SCL  (via drill 0.6)
  Top 0.305: U$3.6 17.46,17.94 v20.32,20.8 | U1.28 25.64,23.89 24.13,25.4 v24.13,30.8 23.89,31.04 RN3.3
  Bottom 0.305: v20.32,20.8 24.13,24.61 v24.13,30.8
SDA  (via drill 0.6)
  Top 0.305: U$3.5 17.46,16.67 20.64,19.84 v21.27,19.84 | U1.27 25.95,24.7 25.24,25.4 v25.24,31.75 25.15,31.84 RN3.4
  Bottom 0.305: v21.27,19.84 25.24,23.81 v25.24,31.75
UART_RX  (via drill 0.6)
  Top 0.305: U1.30 23.9,22.3 22.07,24.12 22.07,28.57 | U4.6 v18.26,24.92 | RN3.1 22.07,28.57 | 22.07,28.57 20.96,27.46 v18.26,27.46
  Bottom 0.305: v18.26,27.46 v18.26,24.92
UART_TX
  Top 0.305: U4.7 18.73,26.19 23.43,21.5 U1.31

### Text on the board
_tsilk: ANT | 1 | INTERFACE + ISP | DAT | ANT | + | - | POWER | - | 1 | Programmer | RESET | USB | HCS | OUTPUTS | + | - | D | KUL FULL v1 / PCB rev 0 | - | A | B | www.elektronika.ba | C | 0 | 1 | 2 | 3 | BUTTONS | KeeUnloq
_bsilk: POWER | www.elektronika.ba | 9-24 AC/DC | OUT-S0 | E | C | OUT-S1 | E | C | OUT-S2 | E | C | OUT-S3 | E | C